# EAGLE design square (EAGLE 6.5.0)
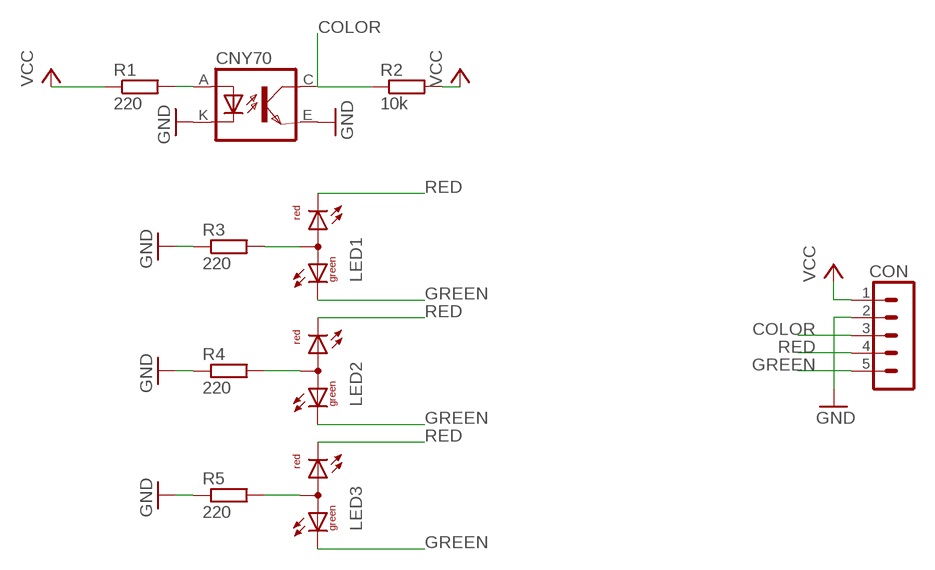
[diagram p0: schematic, sheet 1]

## Parts
CNY70  CNY70  [4]
CON  CON05  [CON05_2.54MM]
LED1  L-115WEGW-CA  [DUOLED-A-3MM]
LED2  L-115WEGW-CA  [DUOLED-A-3MM]
LED3  L-115WEGW-CA  [DUOLED-A-3MM]
R1  220  R-EU_0204/7  [0204/7]
R2  10k  R-EU_0204/7  [0204/7]
R3  220  R-EU_0204/7  [0204/7]
R4  220  R-EU_0204/7  [0204/7]
R5  220  R-EU_0204/7  [0204/7]

## Nets
COLOR: CNY70.C(COL) CON.3 R2.1
GND: CNY70.E(EMI) CNY70.K(C) CON.2 R3.1 R4.1 R5.1
GREEN: CON.5 LED1.1(CG) LED2.1(CG) LED3.1(CG)
N$1: LED1.2(A) R3.2
N$2: CNY70.A R1.2
N$9: LED2.2(A) R4.2
N$10: LED3.2(A) R5.2
RED: CON.4 LED1.3(CR) LED2.3(CR) LED3.3(CR)
VCC: CON.1 R1.1 R2.2

## Library data of the parts
CNY70 = cny70:CNY70
CON = Connectors:CON05
LED1-LED3 = led:L-115WEGW-CA: T-1(3mm) BI-COLOR INDICATOR LAMP Source: Kingbright .. 2_colour_led_.pdf
R1-R5 = resistor:R-EU_: RESISTOR, European symbol

## Board
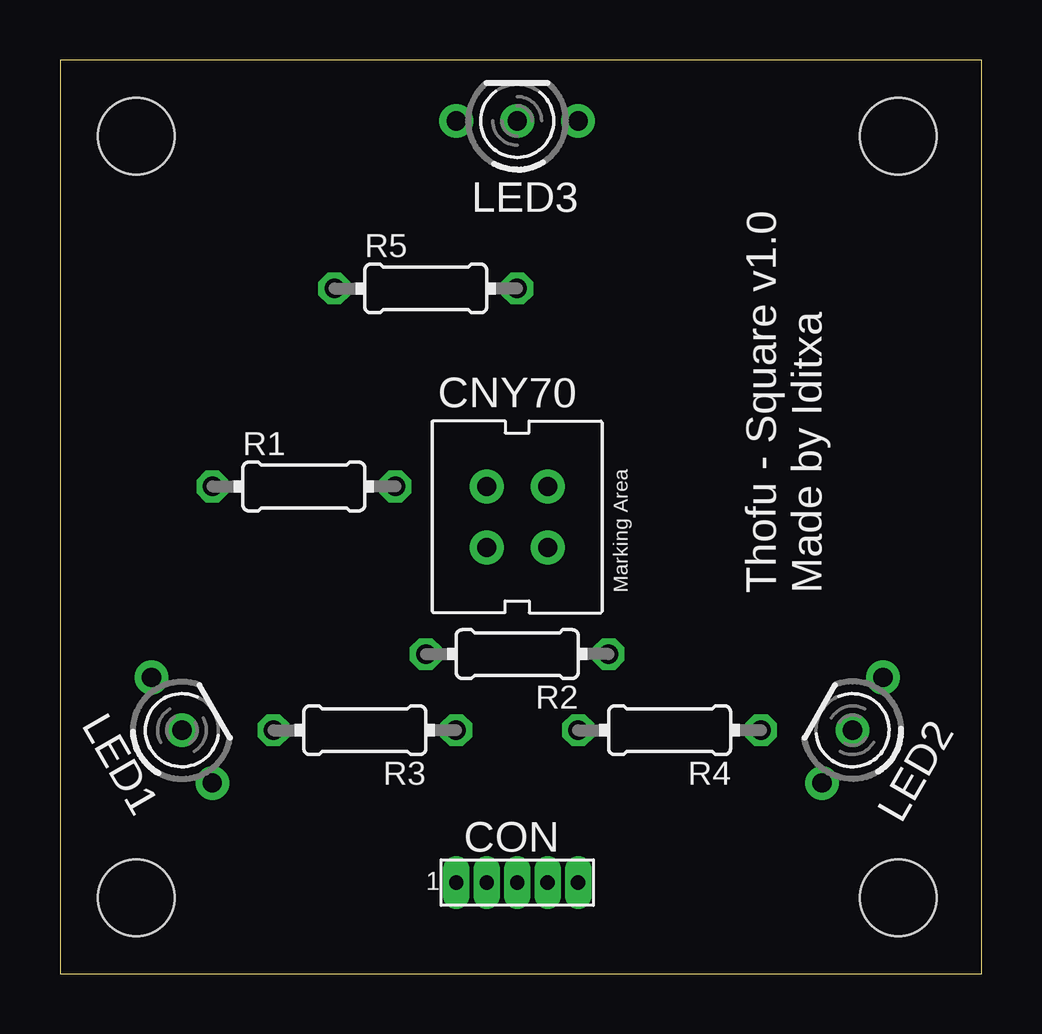
[diagram p1: board, top side]
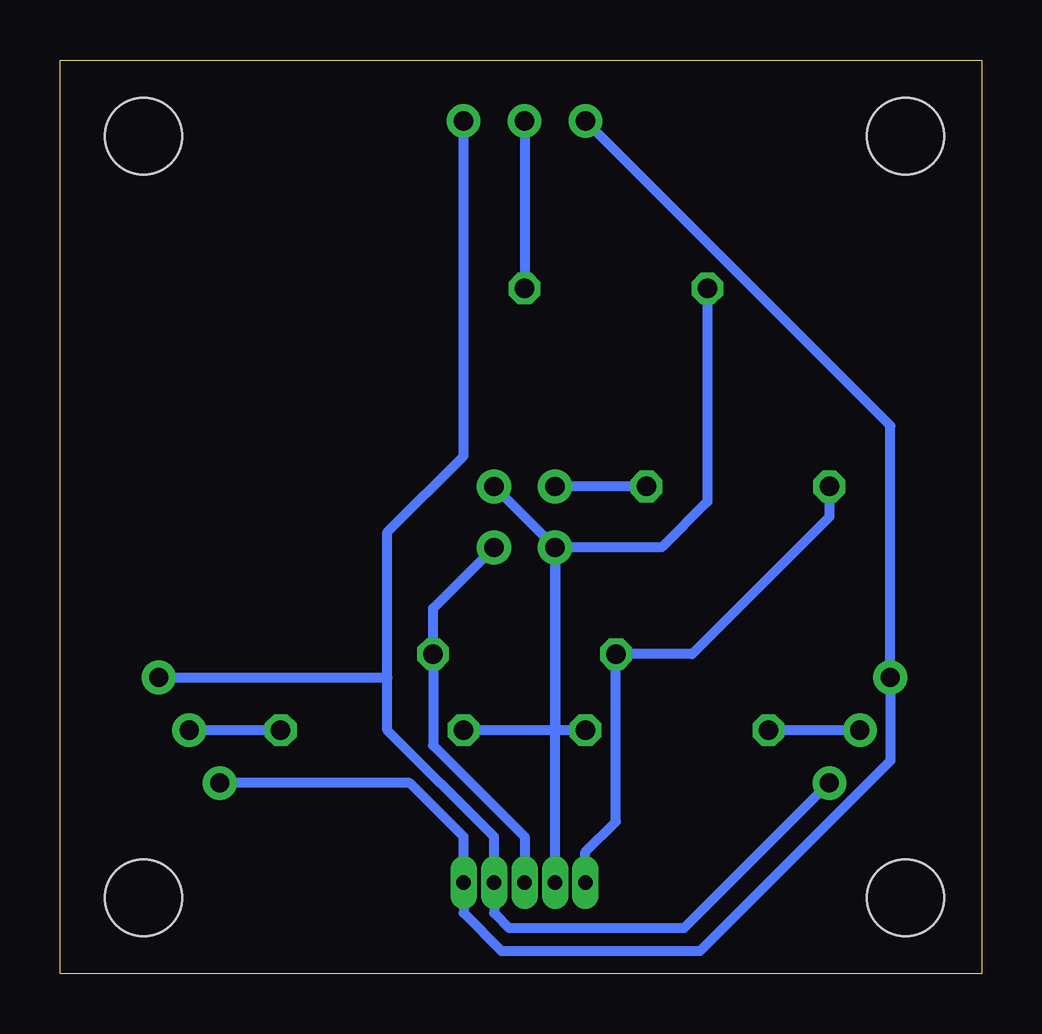
[diagram p2: board, bottom side, seen from below]

Size 38.41 x 38.1 mm. Coordinates in mm from the lower left corner, seen from the top.
Outline: 0,38.09 38.41,38.09 38.41,0 0,0 0,38.1
Copper layers (1*16): Top 0.035mm / dielectric 1.5mm / Bottom 0.035mm
Design rules "default": minimum track width 10mil, minimum drill 24mil, track to track 8mil, track to pad 8mil, pad to pad 8mil, via to via 8mil, smd to smd 8mil, copper to edge 40mil, drill to drill 8mil, minimum pad ring 10mil, minimum via ring 8mil, stop-mask expansion 4mil, vias tented up to drill 0mil, thermal gap 10mil
Holes 3.2 mm at 3.17,34.92 3.17,3.17 34.92,3.17 34.92,34.92

### Footprints (pad centres in the part's own frame; a part is rotated, then mirrored left to right if it is on the bottom)
4 = drill 0.8 pad 1.422: A -1.27,1.27; C 1.27,-1.27; E 1.27,1.27; K -1.27,-1.27
CON05_2.54MM = drill 0.6 pad 0.813 long: 1 -2.54,0; 2 -1.27,0; 3 0,0; 4 1.27,0; 5 2.54,0
DUOLED-A-3MM = drill 0.8 pad 1.4: 1 -2.54,0; 2 0,0; 3 2.54,0
0204/7 = drill 0.813 octagon: 1 -3.81,0; 2 3.81,0

### Placement (x,y rotation side)
CNY70  19.05,19.05 0 top
CON  19.05,3.81 0 top
LED1  5.08,10.16 300 top
LED2  33.02,10.16 60 top
LED3  19.05,35.56 0 top
R1  10.16,20.32 0 top
R2  19.05,13.34 180 top
R3  12.7,10.16 180 top
R4  25.4,10.16 0 top
R5  15.24,28.57 0 top

### Tracks (layer width: path | path; a pad name or v marks a point on that pad's centre or on a via)
COLOR
  Bottom 0.406: CNY70.C 22.86,15.24 R2.1 22.86,9.53 19.05,5.71 CON.3
GND
  Bottom 0.406: R3.1 17.78,10.16 | 17.78,10.16 R4.1 | CNY70.E CNY70.K | CNY70.K 17.78,10.16 | CNY70.K 13.34,17.78 11.43,19.68 R5.1 | CON.2 CNY70.K
GREEN
  Bottom 0.406: LED3.1 3.81,22.86 LED1.1 3.81,8.89 11.75,0.95 20,0.95 21.59,2.54 CON.5 21.59,5.71 23.84,7.96 LED2.1
N$1
  Bottom 0.406: LED1.2 R3.2
N$2
  Bottom 0.406: R1.2 CNY70.A
N$9
  Bottom 0.406: R4.2 LED2.2
N$10
  Bottom 0.406: LED3.2 R5.2
RED
  Bottom 0.406: 24.77,12.36 24.77,10.16 20.32,5.71 CON.4 20.32,2.54 19.68,1.91 12.4,1.91 LED1.3 | 24.77,12.36 24.77,18.41 21.59,21.59 LED3.3 | LED2.3 24.77,12.36
VCC
  Bottom 0.406: R1.1 6.35,19.05 12.06,13.34 R2.2 15.24,6.35 16.51,5.08 CON.1

### Text on the board
tNames: Thofu - Square v1.0 | Made by Iditxa